# Altium schematic sheet 12V_Regulator.SchDoc
size A4
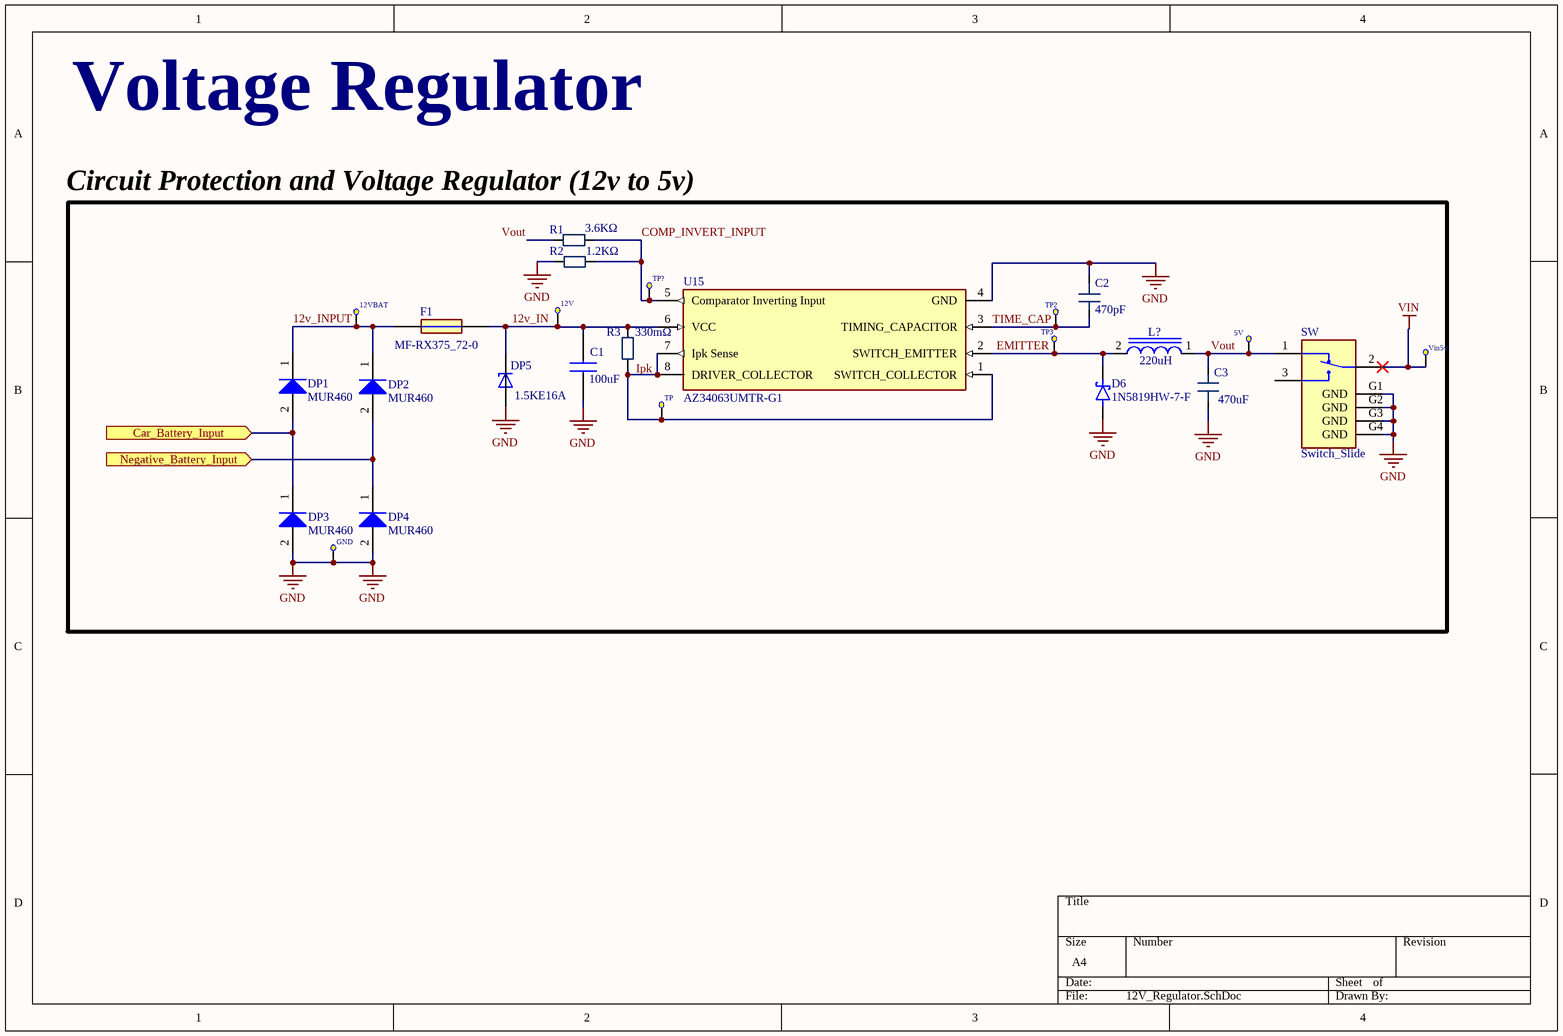
[diagram p0: 12V_Regulator.SchDoc]

## Parts
5V  (no value)  [TestPoint]  (no BOM)
12V  (no value)  [TestPoint]  (no BOM)
12VBAT  (no value)  [TestPoint]  (no BOM)
C1  100uF  [CAP_100uF]
C2  470pF  [Capacitor_SMD_0805_Generic]
C3  470uF  [Capacitor_470uF]
D6  1N5819HW-7-F  [1N5819HW-7-F]
DP1  MUR460  [ONSC-AXIAL_LEAD-2-267-05_V]
DP2  MUR460  [ONSC-AXIAL_LEAD-2-267-05_V]
DP3  MUR460  [ONSC-AXIAL_LEAD-2-267-05_V]
DP4  MUR460  [ONSC-AXIAL_LEAD-2-267-05_V]
DP5  1.5KE16A  [DIOAD1586W101L900D530]
F1  MF-RX375_72-0  [MFRX375720]
GND  (no value)  [TestPoint]  (no BOM)
L?  220uH  [INDP125125X600N]
R1  3.6KΩ  [Resistor_0805_Generic]
R2  1.2KΩ  [Resistor_0805_Generic]
R3  330mΩ  [Resistor_0805_Generic]
SW  Switch_Slide  [Switch_Slide]
TP  (no value)  [TestPoint]  (no BOM)
TP2  (no value)  [TestPoint]  (no BOM)
TP3  (no value)  [TestPoint]  (no BOM)
TP?  (no value)  [TestPoint]  (no BOM)
U15  AZ34063UMTR-G1  [AZ34063UMTR-G1]
Vin5v  (no value)  [TestPoint]  (no BOM)

## Blocks framed on the sheet
Circuit Protection and Voltage Regulator (12v to 5v): 5V 12V 12VBAT C1-C3 D6 DP1-DP5 F1 GND L? R1-R3 SW TP TP2 TP3 TP? U15 Vin5v

## Ports
Car_Battery_Input (in), Negative_Battery_Input (in)

## Nets
GND: C1.1 C2.2 C3.2 D6.A DP3.2(A) DP4.2(A) DP5.A GND.1(Test_Point) R2.2 SW.G1(GND) SW.G2(GND) SW.G3(GND) SW.G4(GND) U15.4(GND)
VIN: SW.2 Vin5v.1(Test_Point)
12v_IN: 12V.1(Test_Point) C1.2 DP5.C F1.2 R3.2 U15.6(VCC)
12v_INPUT: 12VBAT.1(Test_Point) DP1.1(K) DP2.1(K) F1.1
Car_Battery_Input: DP1.2(A) DP3.1(K) ; port Car_Battery_Input
COMP_INVERT_INPUT: R1.1 R2.1 TP?.1(Test_Point) U15.5(Comparator_Inverting_Input)
EMITTER: D6.C(K) L?.2 TP3.1(Test_Point) U15.2(SWITCH_EMITTER)
Negative_Battery_Input: DP2.2(A) DP4.1(K) ; port Negative_Battery_Input
TIME_CAP: C2.1 TP2.1(Test_Point) U15.3(TIMING_CAPACITOR)
Vout: 5V.1(Test_Point) C3.1 L?.1 R1.2 SW.1
NetR3_1: R3.1 TP.1(Test_Point) U15.1(SWITCH_COLLECTOR) U15.7(Ipk_Sense) U15.8(DRIVER_COLLECTOR)

Not connected (* = marked no-connect by the designer): SW 3

## Notes on the sheet
- Voltage Regulator
- Labels drawn without touching a wire or pin: Ipk

## Library data of the parts
5V 12V 12VBAT GND TP TP2 TP3 TP? Vin5v = TestPoint
C1 = Cap_100uF: 100uF +/-20%;  16V; X5R; 1812; Manufacturer_Name: Kyocera AVX; Manufacturer_Part_Number: 1210YD107MAT2A; Geometry.Height: 2.79mm; Mouser Part Number: 581-1210YD107MAT2A; Mouser Price/Stock: https://www.mouser.co.uk/ProductDetail/KYOCERA-AVX/1210YD107MAT2A?qs=dTuOkNN7mNJArH0RUYK6ig%3D%3D; Datasheet Link: https://datasheet.datasheetarchive.com/originals/distributors/DKDS40/DSANUWW008853.pdf
C2 = Capacitor_0805_Generic: 470pF +/-10%;  200V; X7R; 0805
C3 = Capacitor_0805_Generic
D6 = 1N5819HW-7-F: Diode Schottky 40 V 1A Surface Mount SOD-123; MF: Diodes Inc.; Value: *; SnapEDA_Link: https://www.snapeda.com/parts/1N5819HW-7-F/Diodes+Inc./view-part/?ref=snap; Purchase-URL: https://pricing.snapeda.com/search/part/1N5819HW-7-F/?ref=eda; Availability: In Stock; Price: None; Package: SOD-123 Fairchild Semiconductor; Check_prices: https://www.snapeda.com/parts/1N5819HW-7-F/Diodes+Inc./view-part/?ref=eda; MP: 1N5819HW-7-F
DP1-DP4 = CMP-0902-00067-1: MUR460 Power Rectifier, 2-Pin Axial_Lead, Pb-Free, Bulk Bag; Manufacturer: On Semiconductor; IFSM Max (A): 110; VRRM Max (V): 600; DatasheetVersion: Rev. 15; ComponentLink1URL: http://www.onsemi.com/; ComponentLink2URL: http://www.onsemi.cn/pub_link/Collateral/MUR420-D.PDF; Mounting Technology: Through Hole; ComponentLink1Description: Manufacturer URL; ComponentLink2Description: Datasheet; Type: Ultrafast; PackageDescription: 2-Pin, Axial Lead, Diameter 5.05 mm; PartNumber: MUR460; PackageVersion: Rev. G, 06/2000; PackageReference: AXIAL_LEAD-2-267-05; Packing: Bulk Bag; RoHS: TRUE; ComponentLink3URL: http://www.onsemi.com/pub_link/Collateral/267-05.PDF; ComponentLink3Description: Package Specification
DP5 = 1.5KE16A: ESD Protection Diodes/TVS Diodes 1500W 13.6V Uni-Directional; Package: None; Price: None; Value: *; MP: 1.5KE16A; Availability: Unavailable
F1 = MF-RX375_72-0_1: Bourns 3.75A Radial Leaded PCB Mount Resettable Fuse, 72 V; Manufacturer_Part_Number: MF-RX375/72-0; Geometry.Height: 29.51mm; Manufacturer_Name: Bourns; Mouser Part Number: 652-MF-RX375/72-0; Mouser Price/Stock: https://www.mouser.co.uk/ProductDetail/Bourns/MF-RX375-72-0?qs=9FzDyaD7ZFD00YfbCcBudg%3D%3D; Arrow Part Number: MF-RX375/72-0; Arrow Price/Stock: https://www.arrow.com/en/products/mf-rx37572-0/bourns?utm_currency=USD&region=europe; Datasheet Link: https://componentsearchengine.com/Datasheets/2/MF-RX375_72-0.pdf
L? = SRR1260-680M: 68ÂµH Shielded Wirewound Inductor 2.1A 110mOhm Max Nonstandard; MF: Bourns; Package: Nonstandard Bourns; Value: *; Digi-Key_Purchase_URL: https://www.digikey.com/product-detail/en/bourns-inc/SRR1260-680M/SRR1260-680MCT-ND/2127423?utm_source=snapeda&utm_medium=aggregator&utm_campaign=symbol; Digi-Key_Part_Number: SRR1260-680MCT-ND; SnapEDA_Link: https://www.snapeda.com/parts/SRR1260-680M/Bourns/view-part/337191/?ref=snap; MP: SRR1260-680M
R1 = Resistor_0805: 3.6KΩ +-0.5%; 400V; 0805
R2 = Resistor_0805: 1.2KΩ +-1%; 75V; 0805
R3 = Resistor_0805: 330mΩ +-1%; 150V; 0805
SW = Switch_Slide: Switch Slide SPDT Side Slide 0.3A 4VDC Gull Wing SMD Box; MP: MLL1200S; Package: None; Availability: Unavailable; Value: *; Price: None
U15 = AZ34063UMTR-G1: Switching Voltage Regulators 1.5A Step-Down/Up 3.0V to 36V 180kHz